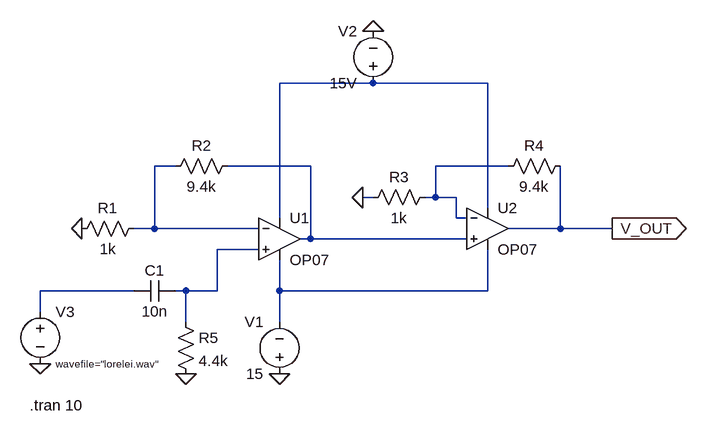
[diagram p0: schematic Amplificator Audio.asc]
Amplificator Audio.asc, the LTspice schematic file:
Version 4.1
SHEET 1 880 680
WIRE 192 160 48 160
WIRE 368 160 192 160
WIRE -112 288 -144 288
WIRE 96 288 -32 288
WIRE 400 288 288 288
WIRE 192 336 176 336
WIRE 288 336 288 288
WIRE 288 336 272 336
WIRE 320 336 288 336
WIRE 368 352 368 160
WIRE 48 368 48 160
WIRE 320 368 320 336
WIRE 336 368 320 368
WIRE -144 384 -144 288
WIRE -144 384 -176 384
WIRE 16 384 -144 384
WIRE 480 384 480 288
WIRE 480 384 400 384
WIRE 560 384 480 384
WIRE 96 400 96 288
WIRE 96 400 80 400
WIRE 336 400 96 400
WIRE 16 416 -48 416
WIRE -176 480 -320 480
WIRE -96 480 -112 480
WIRE -48 480 -48 416
WIRE -48 480 -96 480
WIRE 48 480 48 432
WIRE 368 480 368 416
WIRE 368 480 48 480
WIRE -320 512 -320 480
WIRE -96 528 -96 480
WIRE 48 528 48 480
FLAG -96 608 0
FLAG 176 336 0
FLAG -256 384 0
FLAG 560 384 V_OUT
IOPIN 560 384 Out
FLAG -320 592 0
FLAG 192 80 0
FLAG 48 608 0
SYMBOL OpAmps\\OP07 48 336 R0
SYMATTR InstName U1
SYMBOL cap -112 464 R90
WINDOW 0 0 32 VBottom 2
WINDOW 3 32 32 VTop 2
SYMATTR InstName C1
SYMATTR Value 10n
SYMBOL res -112 512 R0
SYMATTR InstName R5
SYMATTR Value 4.4k
SYMBOL voltage -320 496 R0
WINDOW 3 24 96 Left 1
WINDOW 123 0 0 Left 0
WINDOW 39 0 0 Left 0
SYMATTR InstName V3
SYMATTR Value wavefile="lorelei.wav"
SYMBOL res -160 368 R90
WINDOW 0 0 56 VBottom 2
WINDOW 3 32 56 VTop 2
SYMATTR InstName R1
SYMATTR Value 1k
SYMBOL res -16 272 R90
WINDOW 0 0 56 VBottom 2
WINDOW 3 32 56 VTop 2
SYMATTR InstName R2
SYMATTR Value 9.4k
SYMBOL OpAmps\\OP07 368 320 R0
SYMATTR InstName U2
SYMBOL res 288 320 R90
WINDOW 0 0 56 VBottom 2
WINDOW 3 32 56 VTop 2
SYMATTR InstName R3
SYMATTR Value 1k
SYMBOL res 496 272 R90
WINDOW 0 0 56 VBottom 2
WINDOW 3 32 56 VTop 2
SYMATTR InstName R4
SYMATTR Value 9.4k
SYMBOL voltage 192 176 R180
WINDOW 0 24 96 Left 2
WINDOW 3 24 16 Left 2
SYMATTR InstName V2
SYMATTR Value 15V
SYMBOL voltage 48 624 R180
WINDOW 0 24 96 Left 2
WINDOW 3 24 16 Left 2
WINDOW 123 0 0 Left 0
WINDOW 39 0 0 Left 0
SYMATTR InstName V1
SYMATTR Value 15
TEXT -336 656 Left 2 !.tran 10

The netlist it stands for:
* Amplificator Audio.asc
X§U1 N005 N002 N001 N007 N003 LT1001  ; OP07, pins In+ In- V+ V- OUT
C1 N005 N006 10n
R5 N005 0 4.4k
V3 N006 0 wavefile="lorelei.wav"
R1 N002 0 1k
R2 N003 N002 9.4k
X§U2 N003 N004 N001 N007 V_OUT LT1001  ; OP07, pins In+ In- V+ V- OUT
R3 N004 0 1k
R4 V_OUT N004 9.4k
V2 N001 0 15V
V1 0 N007 15
.tran 10
.lib LTC.lib
.backanno
.end